# EasyEDA Pro project ProPrj_Dolphin 3D.epro, schematic Schematic2
Board Name: Controller; Create Date: 2024-07-03; Page Name: P1; Project Name: Dolphin 3D; Schematic Name: Schematic2; Update Date: 2024-09-18
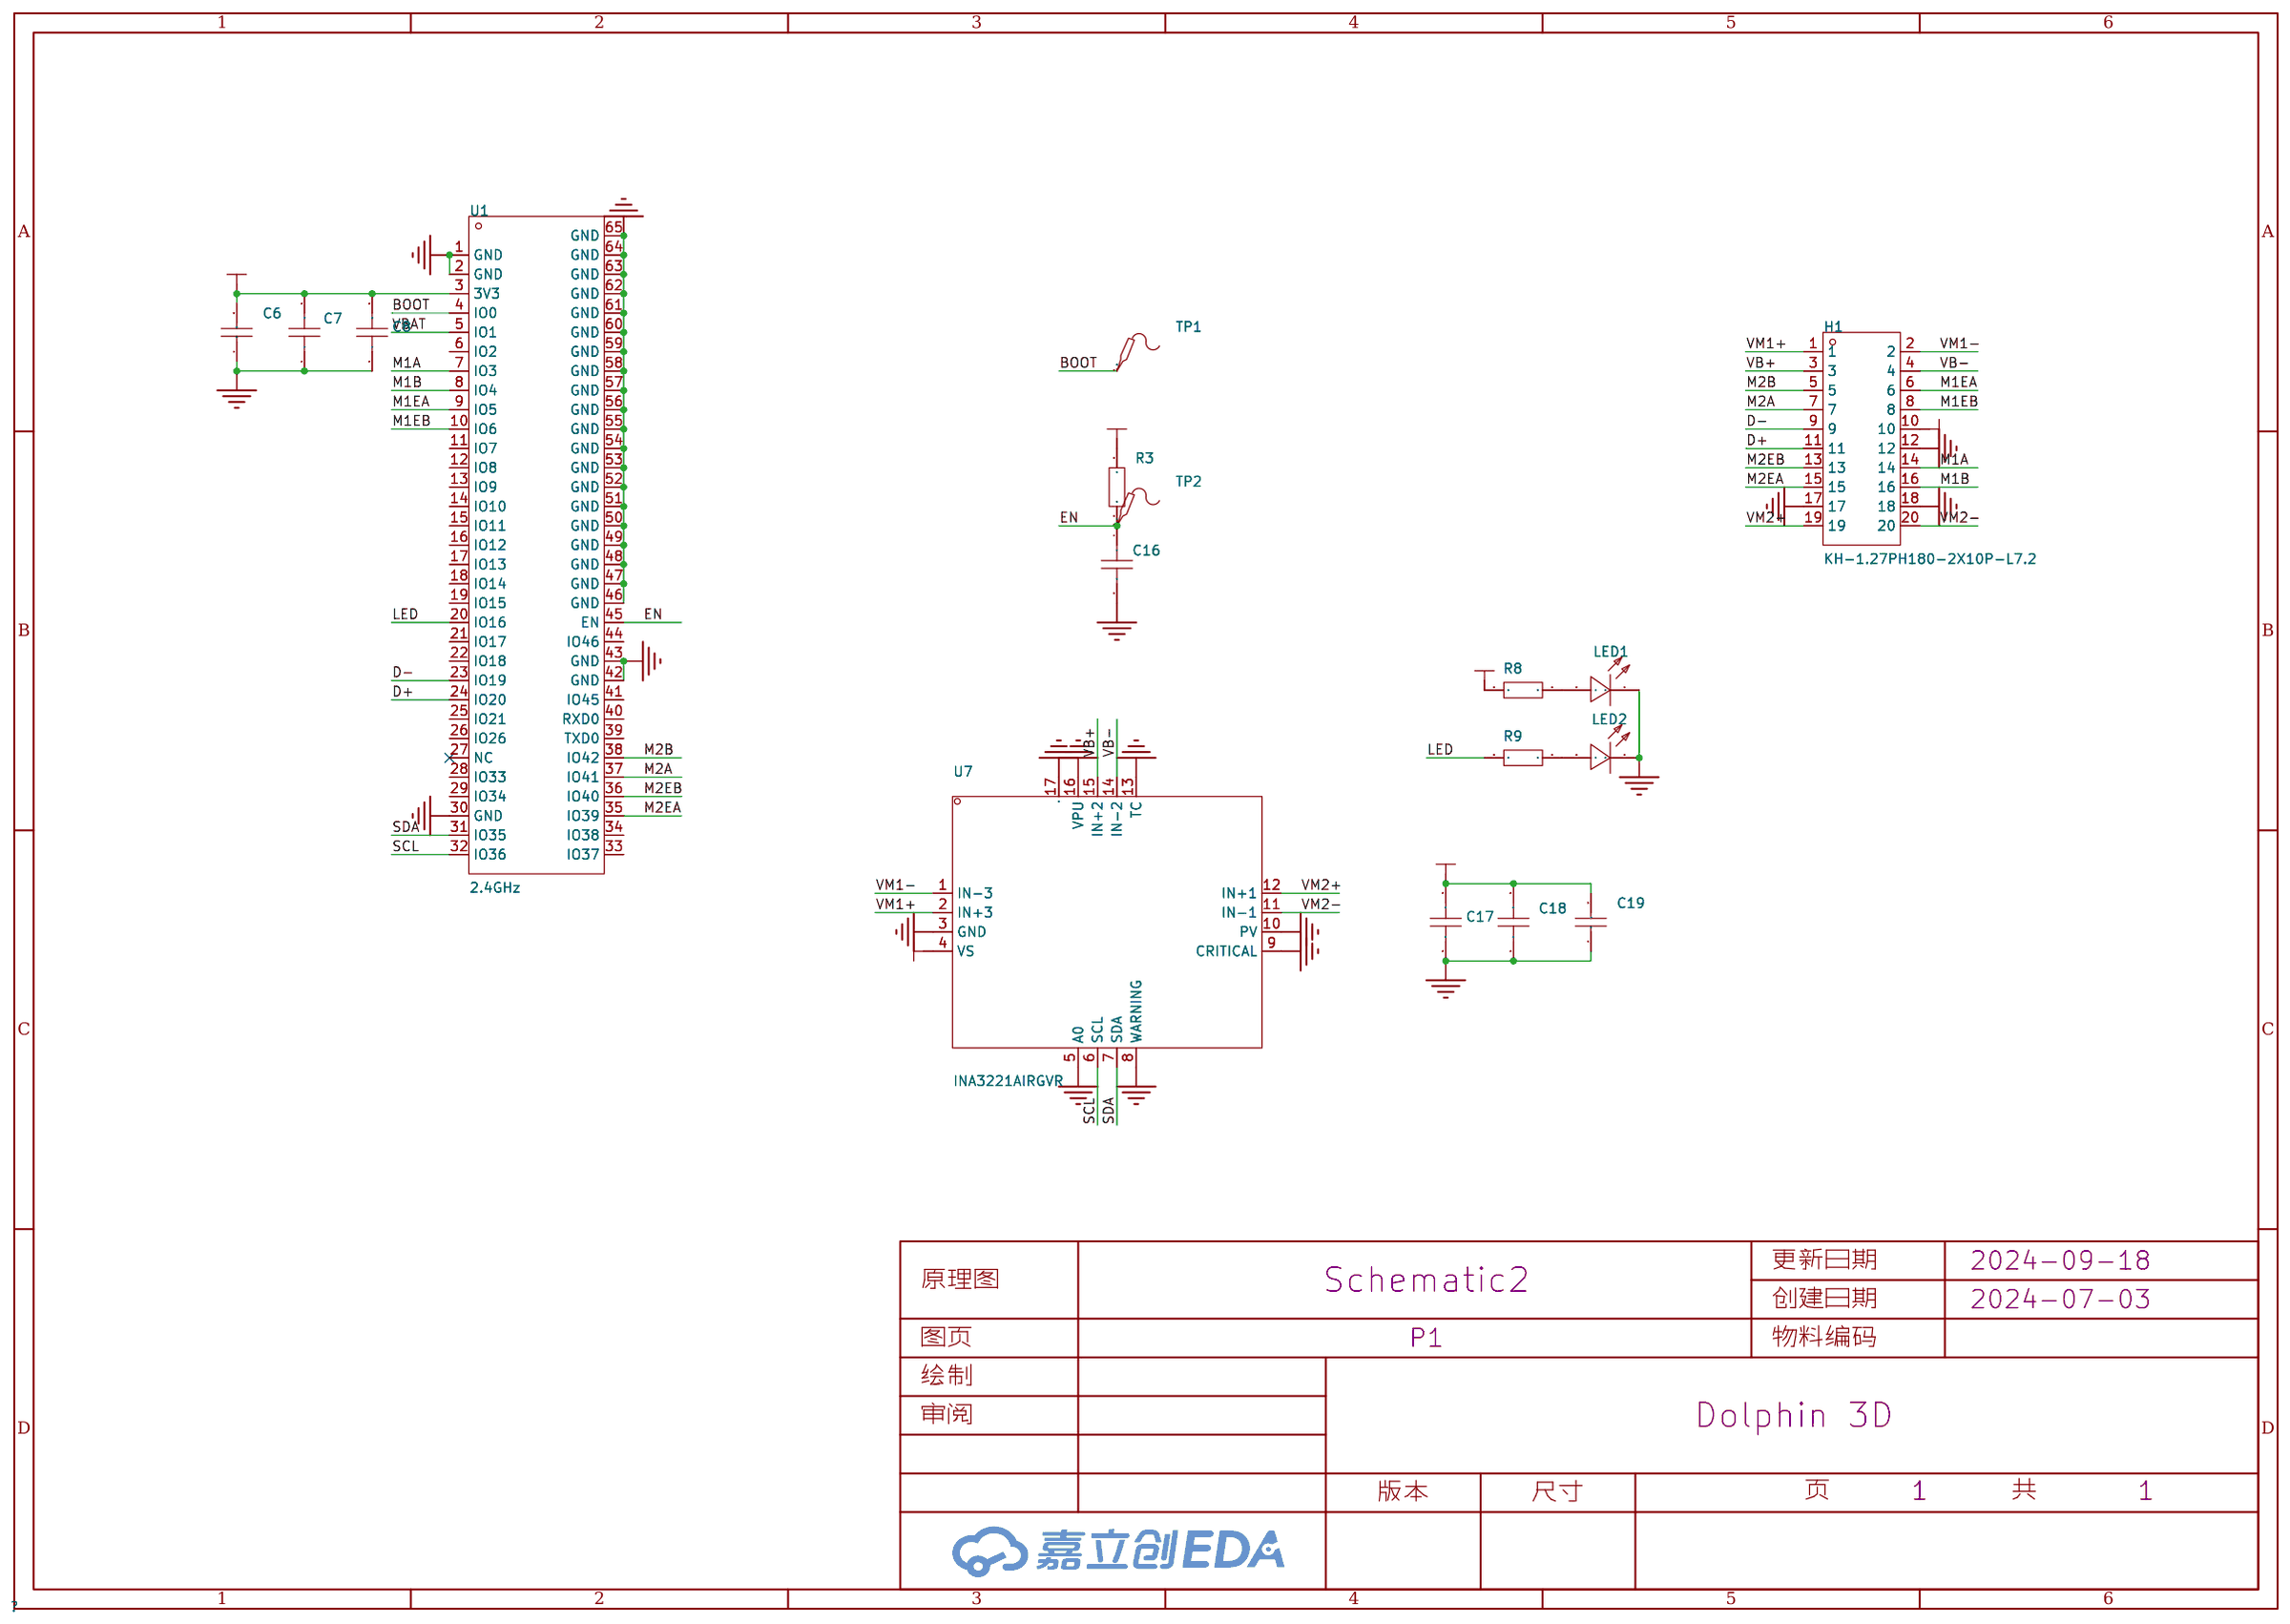
[diagram p1: schematic sheet]

## Parts
C6  100uF  [C1206]
C7  22uF  [C0805]
C8  100nF  [C0402]
C16  1uF  [C0402]
C17  100nF  [C0402]
C18  1uF  [C0402]
C19  100uF  [C1206]
H1  KH-1.27PH180-2X10P-L7.2  [KH-1.27PH180-2X10P-L7.2 夹板]
LED1  KT-0603R  [LED0603-RD]
LED2  KT-0603W  [LED0603-RD]
R3  1kΩ  [R0402]
R8  1kΩ  [R0402]
R9  1kΩ  [R0402]
TP1  -  [Test-Point-0.5mm]
TP2  -  [Test-Point-0.5mm]
U1  2.4GHz  [WIFI-SMD_ESP32-MINI-1-N4]
U7  INA3221AIRGVR  [QFN-16_L4.0-W4.0-P0.65-TL-EP2.2]

## Library data of the parts
C6 C19 = CL31A107MQHNNNE: 容值:100uF;精度:±20%;额定电压:6.3V;材质(温度系数):X5R;; LCSC Part Name: 100uF ±20% 6.3V; Supplier Part: C15008; Manufacturer: SAMSUNG(三星); Supplier Footprint: 1206; JLCPCB Part Class: Basic Part; Datasheet: https://atta.szlcsc.com/upload/public/pdf/source/20160218/1457707763339.pdf; Supplier: LCSC; Tolerance: ±20%; Voltage Rated: 6.3V; Temperature Coefficient: X5R
C7 = CL21A226MAQNNNE: 容值:22uF;精度:±20%;额定电压:25V;材质(温度系数):X5R;; LCSC Part Name: 22uF ±20% 25V; Supplier Part: C45783; Manufacturer: SAMSUNG(三星); Supplier Footprint: 0805; JLCPCB Part Class: Basic Part; Datasheet: https://atta.szlcsc.com/upload/public/pdf/source/20160218/1457707763339.pdf; Supplier: LCSC; Tolerance: ±20%; Voltage Rated: 25V; Temperature Coefficient: X5R
C8 C17 = CL05B104KB54PNC: 容值:100nF;精度:±10%;额定电压:50V;材质(温度系数):X7R;; LCSC Part Name: 100nF ±10% 50V; Supplier Part: C307331; Manufacturer: SAMSUNG(三星); Supplier Footprint: 0402; JLCPCB Part Class: Basic Part; Datasheet: https://atta.szlcsc.com/upload/public/pdf/source/20160218/1457707763339.pdf; Supplier: LCSC; Tolerance: ±10%; Voltage Rated: 50V; Temperature Coefficient: X7R
C16 C18 = CL05A105KA5NQNC: 容值:1uF;精度:±10%;额定电压:25V;材质(温度系数):X5R;; LCSC Part Name: 1uF ±10% 25V; Supplier Part: C52923; Manufacturer: SAMSUNG(三星); Supplier Footprint: 0402; JLCPCB Part Class: Basic Part; Datasheet: https://atta.szlcsc.com/upload/public/pdf/source/20160218/1457707763339.pdf; Supplier: LCSC; Tolerance: ±10%; Voltage Rated: 25V; Temperature Coefficient: X5R
H1 = KH-1.27PH180-2X10P-L7.2: 插针结构:2x10P;间距:1.27mm;行距:1.27mm;圆针/方针:方针;安装类型:直插;排数:双排;总PIN位数:20P;额定电流:1A;额定电压:-;配合针长度:3.9mm;塑高:1mm;端接针长度:2.3mm;工作温度范围:-40℃~+105℃;颜色:-;; LCSC Part Name: 间距:1.27mm 2x10P 直插 方针; Supplier Part: C2938414; Manufacturer: kinghelm(金航标); Supplier Footprint: 插件,P=1.27mm; JLCPCB Part Class: 扩展库; Datasheet: https://atta.szlcsc.com/upload/public/pdf/source/20211228/8CBF5526AEAB9EE683361DBDC78099FA.pdf; Supplier: LCSC; Pin Structure: 2x10P; Pitch: 1.27mm; Row Spacing: 1.27mm; Circluar Pins/Square Pins: 方针; Mounting Type: 直插; Number of Rows: 双排; Number of Pins: 20P; Current Rating (Max): 1A; Length of Mating Pin: 3.9mm; Insulation Height: 1mm; Length of End Connection Pin: 2.3mm; Operating Temperature Range: -40℃~+105℃
LED1 = KT-0603R: 发光颜色:红色;功率:-;正向电流:-;主波长:-;二极管配置:-;透镜颜色:-;色温:-;发光角度:-;载带方式:-;工作温度:-40~+85;; LCSC Part Name: 0603 红灯 高亮; Supplier Part: C2286; Manufacturer: KENTO; Supplier Footprint: 0603; JLCPCB Part Class: Basic Part; Datasheet: https://atta.szlcsc.com/upload/public/pdf/source/20160616/1466072038404.pdf; Supplier: LCSC; Emitted Color: 红色; Operating Temperature: -40~+85
LED2 = KT-0603W: 发光颜色:白色;; LCSC Part Name: 0603 白灯 高亮; Supplier Part: C2290; Manufacturer: KENTO; Supplier Footprint: 0603; JLCPCB Part Class: Basic Part; Datasheet: https://atta.szlcsc.com/upload/public/pdf/source/20221101/4C23D5C85BA051E44A00B833D0A41468.pdf; Supplier: LCSC; Emitted Color: 白色
R3 R8 R9 = 0402WGF1001TCE: 电阻类型:厚膜电阻;阻值:1kΩ;精度:±1%;功率:62.5mW;最大工作电压:50V;温度系数:±100ppm/;; LCSC Part Name: 1kΩ ±1% 62.5mW 厚膜电阻; Supplier Part: C11702; Manufacturer: UNI-ROYAL(厚声); Supplier Footprint: 0402; JLCPCB Part Class: Basic Part; Datasheet: https://atta.szlcsc.com/upload/public/pdf/source/20200306/C422600_1E6D84923E4A46A82E41ADD87F860B5C.pdf; Supplier: LCSC; Type: 厚膜电阻; Tolerance: ±1%; Power(Watts): 62.5mW; Overload Voltage (Max): 50V; Temperature Coefficient: ±100ppm/; Operating Temperature Range: -55~+155
TP1 TP2 = Test-Point: Test Point 测试点
U1 = ESP32-S2-MINI-2-N4: 核心处理器:ESP32-S2FH4芯片;频率:2.4GHz;发射功率:19.5dBm;; Supplier Part: C3013906; Manufacturer: ESPRESSIF(乐鑫); Supplier Footprint: VFQFN-56-EP; JLCPCB Part Class: Extended Part; Datasheet: https://atta.szlcsc.com/upload/public/pdf/source/20220815/99ECD7479F9259A66C7C6E1140388E9F.pdf; Supplier: LCSC; Core Processor: ESP32-S2FH4芯片; Support Interface: I2C；GPIO；SPI；PWM；ADC；UART；USB；I2S; Output Power: 19.5dBm
U7 = INA3221AIRGVR: INA3221 支持报警功能的 26V、三路、双向、零漂移、低侧/高侧、I2C 输出电流/功率监控器; Supplier Part: C181255; Manufacturer: TI(德州仪器); Supplier Footprint: QFN-16-EP(4x4); JLCPCB Part Class: 扩展库; Datasheet: https://www.ti.com/cn/lit/gpn/ina3221; Supplier: LCSC

## Nets
+3V3: C6.2 C7.2 C8.2 C17.2 C18.2 C19.2 H1.10 R3.2 R8.2 U1.3(3V3) U7.4(VS)
GND: C6.1 C7.1 C8.1 C16.2 C17.1 C18.1 C19.1 H1.12 H1.17 H1.18 LED1.1(K) LED2.1(K) U1.1(GND) U1.2(GND) U1.30(GND) U1.42(GND) U1.43(GND) U1.46(GND) U1.47(GND) U1.48(GND) U1.49(GND) U1.50(GND) U1.51(GND) U1.52(GND) U1.53(GND) U1.54(GND) U1.55(GND) U1.56(GND) U1.57(GND) U1.58(GND) U1.59(GND) U1.60(GND) U1.61(GND) U1.62(GND) U1.63(GND) U1.64(GND) U1.65(GND) U7.3(GND) U7.5(A0) U7.8(WARNING) U7.9(CRITICAL) U7.10(PV) U7.13(TC) U7.16(VPU) U7.17(PAD)
VBAT: U1.5(IO1)
BOOT: TP1.1 U1.4(IO0)
D+: H1.11 U1.24(IO20)
D-: H1.9 U1.23(IO19)
EN: C16.1 R3.1 TP2.1 U1.45(EN)
LED: R9.2 U1.20(IO16)
M1A: H1.14 U1.7(IO3)
M1B: H1.16 U1.8(IO4)
M1EA: H1.6 U1.9(IO5)
M1EB: H1.8 U1.10(IO6)
M2A: H1.7 U1.37(IO41)
M2B: H1.5 U1.38(IO42)
M2EA: H1.15 U1.35(IO39)
M2EB: H1.13 U1.36(IO40)
SCL: U1.32(IO36) U7.6(SCL)
SDA: U1.31(IO35) U7.7(SDA)
VB+: H1.3 U7.15(IN+2)
VB-: H1.4 U7.14(IN-2)
VM1+: H1.1 U7.2(IN+3)
VM1-: H1.2 U7.1(IN-3)
VM2+: H1.19 U7.12(IN+1)
VM2-: H1.20 U7.11(IN-1)
$1N832: LED1.2(A) R8.1
$1N833: LED2.2(A) R9.1

Not connected (* = marked no-connect by the designer): U1 6(IO2) 11(IO7) 12(IO8) 13(IO9) 14(IO10) 15(IO11) 16(IO12) 17(IO13) 18(IO14) 19(IO15) 21(IO17) 22(IO18) 25(IO21) 26(IO26) 27(NC)* 28(IO33) 29(IO34) 33(IO37) 34(IO38) 39(TXD0) 40(RXD0) 41(IO45) 44(IO46)
